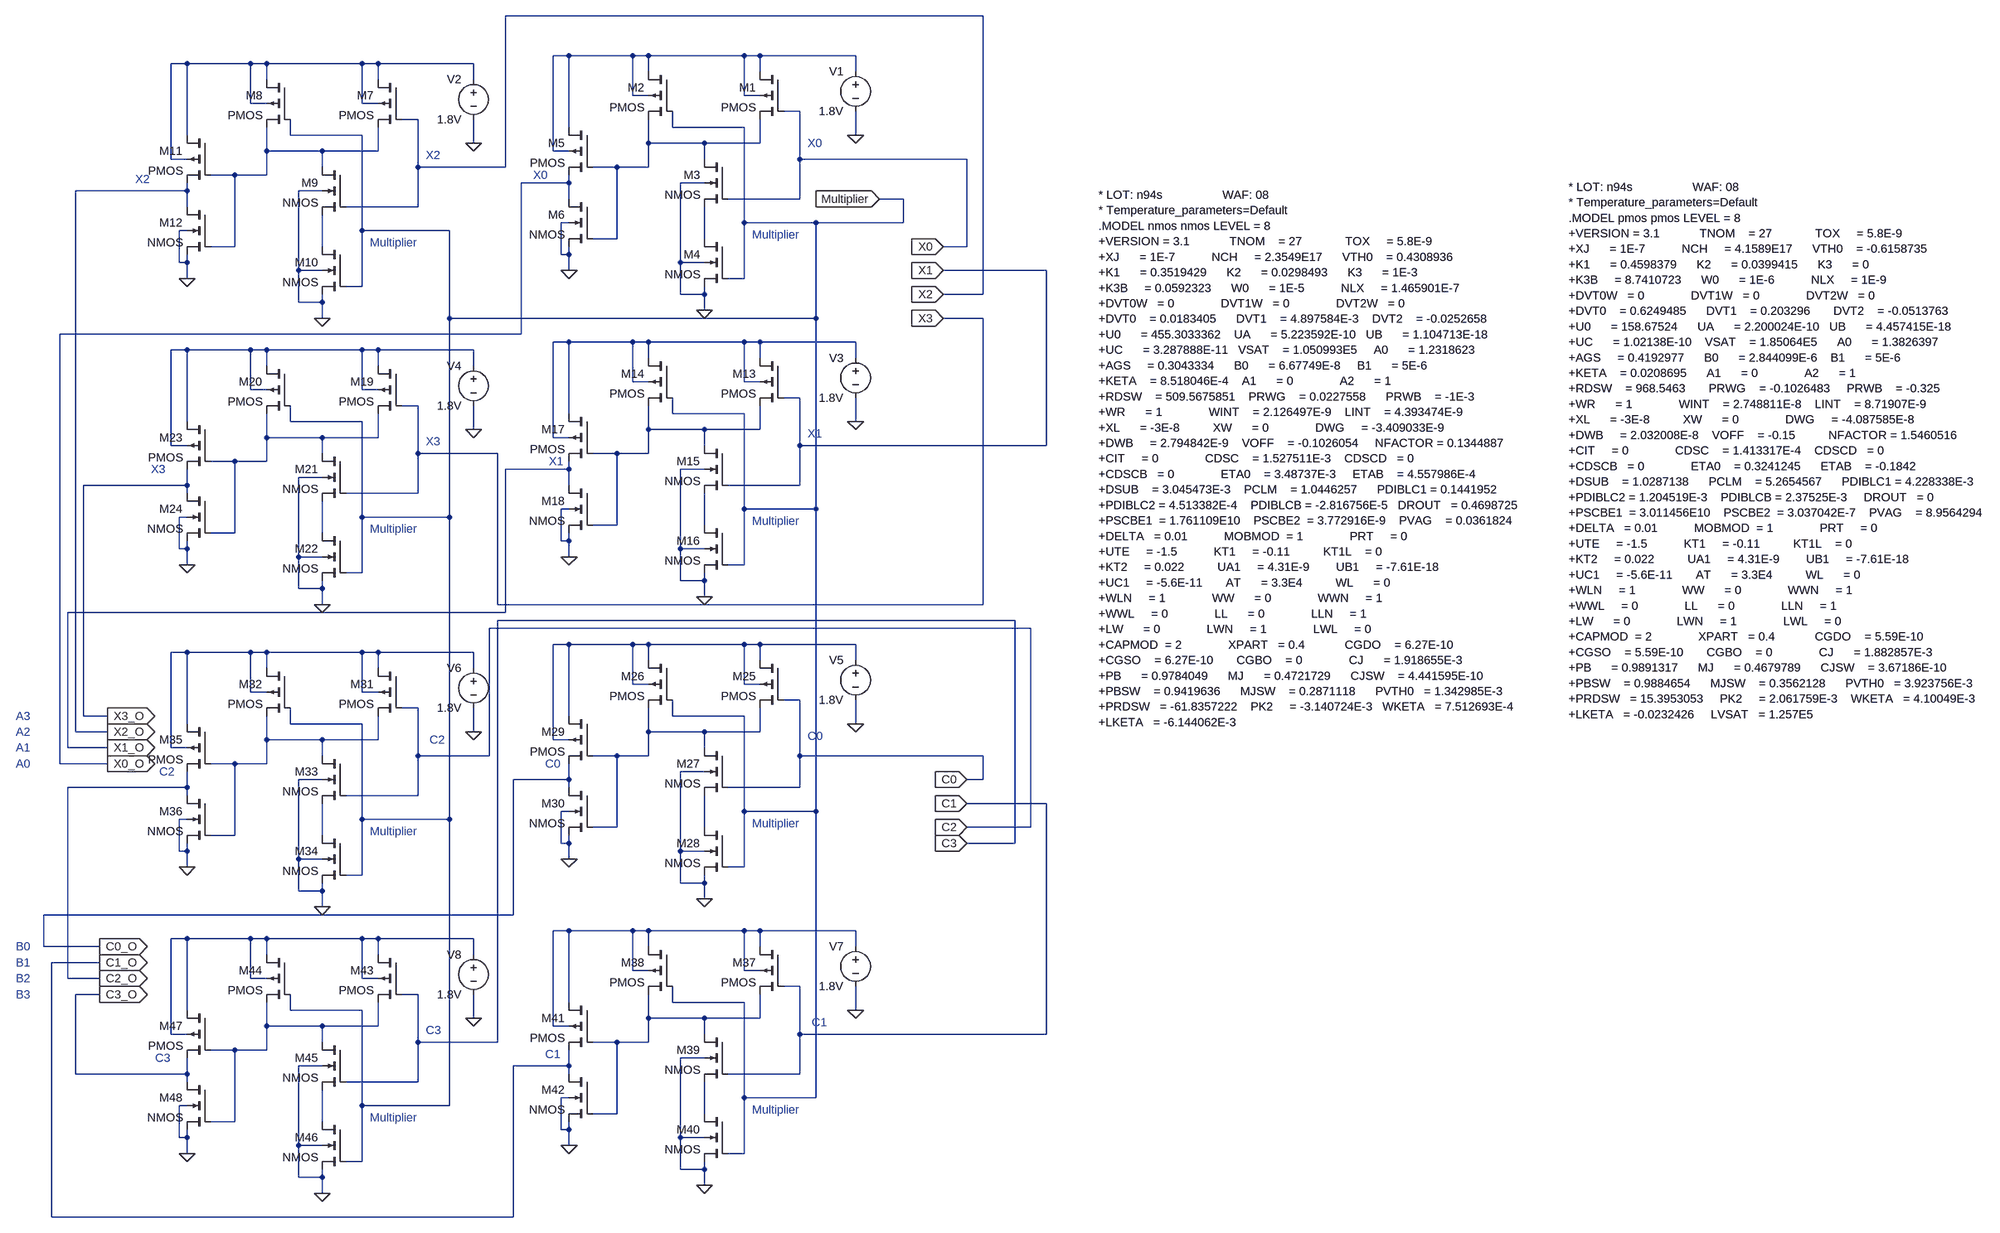
[diagram p0: schematic Logic_Circuit_Multiply.asc]
Logic_Circuit_Multiply.asc, the LTspice schematic file:
Version 4
SHEET 1 4616 1940
WIRE 1552 -480 592 -480
WIRE 720 -400 688 -400
WIRE 848 -400 720 -400
WIRE 880 -400 848 -400
WIRE 1072 -400 880 -400
WIRE 1104 -400 1072 -400
WIRE 1296 -400 1104 -400
WIRE -48 -384 -80 -384
WIRE 80 -384 -48 -384
WIRE 112 -384 80 -384
WIRE 304 -384 112 -384
WIRE 336 -384 304 -384
WIRE 528 -384 336 -384
WIRE 880 -368 880 -400
WIRE 1104 -368 1104 -400
WIRE 1296 -368 1296 -400
WIRE 112 -352 112 -384
WIRE 336 -352 336 -384
WIRE 528 -352 528 -384
WIRE 848 -320 848 -400
WIRE 880 -320 848 -320
WIRE 1072 -320 1072 -400
WIRE 1104 -320 1072 -320
WIRE 80 -304 80 -384
WIRE 112 -304 80 -304
WIRE 304 -304 304 -384
WIRE 336 -304 304 -304
WIRE 1184 -288 1152 -288
WIRE 416 -272 384 -272
WIRE 720 -256 720 -400
WIRE 928 -256 928 -288
WIRE 1072 -256 928 -256
WIRE -48 -240 -48 -384
WIRE 160 -240 160 -272
WIRE 304 -240 160 -240
WIRE 1296 -240 1296 -288
WIRE 528 -224 528 -272
WIRE 880 -224 880 -272
WIRE 992 -224 880 -224
WIRE 1104 -224 1104 -272
WIRE 1104 -224 992 -224
WIRE 112 -208 112 -256
WIRE 224 -208 112 -208
WIRE 336 -208 336 -256
WIRE 336 -208 224 -208
WIRE 688 -208 688 -400
WIRE 720 -208 688 -208
WIRE -80 -192 -80 -384
WIRE -48 -192 -80 -192
WIRE 992 -192 992 -224
WIRE 1184 -192 1184 -288
WIRE 1520 -192 1184 -192
WIRE 224 -176 224 -208
WIRE 416 -176 416 -272
WIRE 592 -176 592 -480
WIRE 592 -176 416 -176
WIRE 816 -176 768 -176
WIRE 880 -176 880 -224
WIRE 880 -176 816 -176
WIRE 48 -160 0 -160
WIRE 112 -160 112 -208
WIRE 112 -160 48 -160
WIRE 720 -144 720 -160
WIRE 720 -144 624 -144
WIRE 992 -144 944 -144
WIRE -48 -128 -48 -144
WIRE -48 -128 -272 -128
WIRE 224 -128 176 -128
WIRE 720 -112 720 -144
WIRE 1184 -112 1184 -192
WIRE 1184 -112 1040 -112
WIRE 1392 -112 1344 -112
WIRE -48 -96 -48 -128
WIRE 416 -96 416 -176
WIRE 416 -96 272 -96
WIRE 720 -64 704 -64
WIRE 1072 -64 1072 -256
WIRE 1216 -64 1072 -64
WIRE 1392 -64 1392 -112
WIRE 1392 -64 1216 -64
WIRE -48 -48 -64 -48
WIRE 304 -48 304 -240
WIRE 480 -48 304 -48
WIRE 816 -32 816 -176
WIRE 816 -32 768 -32
WIRE 992 -32 992 -96
WIRE 48 -16 48 -160
WIRE 48 -16 0 -16
WIRE 224 -16 224 -80
WIRE 1520 -16 1520 -192
WIRE 1520 -16 1472 -16
WIRE 704 0 704 -64
WIRE 720 0 720 -16
WIRE 720 0 704 0
WIRE -64 16 -64 -48
WIRE -48 16 -48 0
WIRE -48 16 -64 16
WIRE 944 16 944 -144
WIRE 992 16 944 16
WIRE 176 32 176 -128
WIRE 224 32 176 32
WIRE 720 32 720 0
WIRE 1680 32 1472 32
WIRE -48 48 -48 16
WIRE 1072 48 1072 -64
WIRE 1072 48 1040 48
WIRE 304 64 304 -48
WIRE 304 64 272 64
WIRE 944 80 944 16
WIRE 992 80 992 64
WIRE 992 80 944 80
WIRE 1552 80 1552 -480
WIRE 1552 80 1472 80
WIRE 176 96 176 32
WIRE 224 96 224 80
WIRE 224 96 176 96
WIRE 992 112 992 80
WIRE 224 128 224 96
WIRE 480 128 480 -48
WIRE 1216 128 1216 -64
WIRE 1216 128 480 128
WIRE 1552 128 1472 128
WIRE 624 160 624 -144
WIRE 624 160 -304 160
WIRE 720 176 688 176
WIRE 848 176 720 176
WIRE 880 176 848 176
WIRE 1072 176 880 176
WIRE 1104 176 1072 176
WIRE 1296 176 1104 176
WIRE -48 192 -80 192
WIRE 80 192 -48 192
WIRE 112 192 80 192
WIRE 304 192 112 192
WIRE 336 192 304 192
WIRE 528 192 336 192
WIRE 880 208 880 176
WIRE 1104 208 1104 176
WIRE 1296 208 1296 176
WIRE 112 224 112 192
WIRE 336 224 336 192
WIRE 528 224 528 192
WIRE 848 256 848 176
WIRE 880 256 848 256
WIRE 1072 256 1072 176
WIRE 1104 256 1072 256
WIRE 80 272 80 192
WIRE 112 272 80 272
WIRE 304 272 304 192
WIRE 336 272 304 272
WIRE 1184 288 1152 288
WIRE 416 304 384 304
WIRE 720 320 720 176
WIRE 928 320 928 288
WIRE 1072 320 928 320
WIRE -48 336 -48 192
WIRE 160 336 160 304
WIRE 304 336 160 336
WIRE 1296 336 1296 288
WIRE 528 352 528 304
WIRE 880 352 880 304
WIRE 992 352 880 352
WIRE 1104 352 1104 304
WIRE 1104 352 992 352
WIRE 112 368 112 320
WIRE 224 368 112 368
WIRE 336 368 336 320
WIRE 336 368 224 368
WIRE 688 368 688 176
WIRE 720 368 688 368
WIRE -80 384 -80 192
WIRE -48 384 -80 384
WIRE 992 384 992 352
WIRE 1184 384 1184 288
WIRE 1680 384 1680 32
WIRE 1680 384 1184 384
WIRE 224 400 224 368
WIRE 416 400 416 304
WIRE 576 400 416 400
WIRE 816 400 768 400
WIRE 880 400 880 352
WIRE 880 400 816 400
WIRE 48 416 0 416
WIRE 112 416 112 368
WIRE 112 416 48 416
WIRE 720 432 720 416
WIRE 720 432 592 432
WIRE 992 432 944 432
WIRE 224 448 176 448
WIRE -48 464 -48 432
WIRE -48 464 -256 464
WIRE 720 464 720 432
WIRE 1184 464 1184 384
WIRE 1184 464 1040 464
WIRE -48 480 -48 464
WIRE 416 480 416 400
WIRE 416 480 272 480
WIRE 720 512 704 512
WIRE 1072 512 1072 320
WIRE 1216 512 1216 128
WIRE 1216 512 1072 512
WIRE -48 528 -64 528
WIRE 304 528 304 336
WIRE 480 528 480 128
WIRE 480 528 304 528
WIRE 816 544 816 400
WIRE 816 544 768 544
WIRE 992 544 992 480
WIRE 48 560 48 416
WIRE 48 560 0 560
WIRE 224 560 224 496
WIRE 704 576 704 512
WIRE 720 576 720 560
WIRE 720 576 704 576
WIRE -64 592 -64 528
WIRE -48 592 -48 576
WIRE -48 592 -64 592
WIRE 944 592 944 432
WIRE 992 592 944 592
WIRE 176 608 176 448
WIRE 224 608 176 608
WIRE 720 608 720 576
WIRE -48 624 -48 592
WIRE 1072 624 1072 512
WIRE 1072 624 1040 624
WIRE 304 640 304 528
WIRE 304 640 272 640
WIRE 944 656 944 592
WIRE 992 656 992 640
WIRE 992 656 944 656
WIRE 176 672 176 608
WIRE 224 672 224 656
WIRE 224 672 176 672
WIRE 992 688 992 656
WIRE 224 704 224 672
WIRE 576 704 576 400
WIRE 1552 704 1552 128
WIRE 1552 704 576 704
WIRE 592 720 592 432
WIRE 592 720 -288 720
WIRE 1616 736 576 736
WIRE 1648 752 560 752
WIRE 720 784 688 784
WIRE 848 784 720 784
WIRE 880 784 848 784
WIRE 1072 784 880 784
WIRE 1104 784 1072 784
WIRE 1296 784 1104 784
WIRE -48 800 -80 800
WIRE 80 800 -48 800
WIRE 112 800 80 800
WIRE 304 800 112 800
WIRE 336 800 304 800
WIRE 528 800 336 800
WIRE 880 816 880 784
WIRE 1104 816 1104 784
WIRE 1296 816 1296 784
WIRE 112 832 112 800
WIRE 336 832 336 800
WIRE 528 832 528 800
WIRE 848 864 848 784
WIRE 880 864 848 864
WIRE 1072 864 1072 784
WIRE 1104 864 1072 864
WIRE 80 880 80 800
WIRE 112 880 80 880
WIRE 304 880 304 800
WIRE 336 880 304 880
WIRE 1184 896 1152 896
WIRE 416 912 384 912
WIRE -256 928 -256 464
WIRE -208 928 -256 928
WIRE 720 928 720 784
WIRE 928 928 928 896
WIRE 1072 928 928 928
WIRE -48 944 -48 800
WIRE 160 944 160 912
WIRE 304 944 160 944
WIRE 1296 944 1296 896
WIRE -272 960 -272 -128
WIRE -208 960 -272 960
WIRE 528 960 528 912
WIRE 880 960 880 912
WIRE 992 960 880 960
WIRE 1104 960 1104 912
WIRE 1104 960 992 960
WIRE 112 976 112 928
WIRE 224 976 112 976
WIRE 336 976 336 928
WIRE 336 976 224 976
WIRE 688 976 688 784
WIRE 720 976 688 976
WIRE -288 992 -288 720
WIRE -208 992 -288 992
WIRE -80 992 -80 800
WIRE -48 992 -80 992
WIRE 992 992 992 960
WIRE 224 1008 224 976
WIRE 416 1008 416 912
WIRE 560 1008 560 752
WIRE 560 1008 416 1008
WIRE 816 1008 768 1008
WIRE 880 1008 880 960
WIRE 880 1008 816 1008
WIRE 1184 1008 1184 896
WIRE 1552 1008 1184 1008
WIRE -304 1024 -304 160
WIRE -208 1024 -304 1024
WIRE 48 1024 0 1024
WIRE 112 1024 112 976
WIRE 112 1024 48 1024
WIRE 992 1040 944 1040
WIRE 224 1056 176 1056
WIRE 720 1056 720 1024
WIRE 720 1056 608 1056
WIRE 1552 1056 1552 1008
WIRE 1552 1056 1520 1056
WIRE -48 1072 -48 1040
WIRE -48 1072 -288 1072
WIRE 720 1072 720 1056
WIRE 1184 1072 1184 1008
WIRE 1184 1072 1040 1072
WIRE -48 1088 -48 1072
WIRE 416 1088 416 1008
WIRE 416 1088 272 1088
WIRE 1680 1104 1520 1104
WIRE 720 1120 704 1120
WIRE 1072 1120 1072 928
WIRE 1216 1120 1216 512
WIRE 1216 1120 1072 1120
WIRE -48 1136 -64 1136
WIRE 304 1136 304 944
WIRE 480 1136 480 528
WIRE 480 1136 304 1136
WIRE 816 1152 816 1008
WIRE 816 1152 768 1152
WIRE 992 1152 992 1088
WIRE 1648 1152 1648 752
WIRE 1648 1152 1520 1152
WIRE 48 1168 48 1024
WIRE 48 1168 0 1168
WIRE 224 1168 224 1104
WIRE 704 1184 704 1120
WIRE 720 1184 720 1168
WIRE 720 1184 704 1184
WIRE 1616 1184 1616 736
WIRE 1616 1184 1520 1184
WIRE -64 1200 -64 1136
WIRE -48 1200 -48 1184
WIRE -48 1200 -64 1200
WIRE 944 1200 944 1040
WIRE 992 1200 944 1200
WIRE 176 1216 176 1056
WIRE 224 1216 176 1216
WIRE 720 1216 720 1184
WIRE -48 1232 -48 1200
WIRE 1072 1232 1072 1120
WIRE 1072 1232 1040 1232
WIRE 304 1248 304 1136
WIRE 304 1248 272 1248
WIRE 944 1264 944 1200
WIRE 992 1264 992 1248
WIRE 992 1264 944 1264
WIRE 176 1280 176 1216
WIRE 224 1280 224 1264
WIRE 224 1280 176 1280
WIRE 992 1296 992 1264
WIRE 224 1312 224 1280
WIRE 608 1328 608 1056
WIRE 608 1328 -336 1328
WIRE 720 1360 688 1360
WIRE 848 1360 720 1360
WIRE 880 1360 848 1360
WIRE 1072 1360 880 1360
WIRE 1104 1360 1072 1360
WIRE 1296 1360 1104 1360
WIRE -48 1376 -80 1376
WIRE 80 1376 -48 1376
WIRE 112 1376 80 1376
WIRE 304 1376 112 1376
WIRE 336 1376 304 1376
WIRE 528 1376 336 1376
WIRE -336 1392 -336 1328
WIRE -224 1392 -336 1392
WIRE 880 1392 880 1360
WIRE 1104 1392 1104 1360
WIRE 1296 1392 1296 1360
WIRE 112 1408 112 1376
WIRE 336 1408 336 1376
WIRE 528 1408 528 1376
WIRE -224 1424 -320 1424
WIRE 848 1440 848 1360
WIRE 880 1440 848 1440
WIRE 1072 1440 1072 1360
WIRE 1104 1440 1072 1440
WIRE -288 1456 -288 1072
WIRE -224 1456 -288 1456
WIRE 80 1456 80 1376
WIRE 112 1456 80 1456
WIRE 304 1456 304 1376
WIRE 336 1456 304 1456
WIRE 1184 1472 1152 1472
WIRE -224 1488 -272 1488
WIRE 416 1488 384 1488
WIRE 720 1504 720 1360
WIRE 928 1504 928 1472
WIRE 1072 1504 928 1504
WIRE -48 1520 -48 1376
WIRE 160 1520 160 1488
WIRE 304 1520 160 1520
WIRE 1296 1520 1296 1472
WIRE 528 1536 528 1488
WIRE 880 1536 880 1488
WIRE 992 1536 880 1536
WIRE 1104 1536 1104 1488
WIRE 1104 1536 992 1536
WIRE 112 1552 112 1504
WIRE 224 1552 112 1552
WIRE 336 1552 336 1504
WIRE 336 1552 224 1552
WIRE 688 1552 688 1360
WIRE 720 1552 688 1552
WIRE -80 1568 -80 1376
WIRE -48 1568 -80 1568
WIRE 992 1568 992 1536
WIRE 1184 1568 1184 1472
WIRE 1680 1568 1680 1104
WIRE 1680 1568 1184 1568
WIRE 224 1584 224 1552
WIRE 416 1584 416 1488
WIRE 576 1584 576 736
WIRE 576 1584 416 1584
WIRE 816 1584 768 1584
WIRE 880 1584 880 1536
WIRE 880 1584 816 1584
WIRE 48 1600 0 1600
WIRE 112 1600 112 1552
WIRE 112 1600 48 1600
WIRE 992 1616 944 1616
WIRE 224 1632 176 1632
WIRE 720 1632 720 1600
WIRE 720 1632 608 1632
WIRE -272 1648 -272 1488
WIRE -48 1648 -48 1616
WIRE -48 1648 -272 1648
WIRE 720 1648 720 1632
WIRE 1184 1648 1184 1568
WIRE 1184 1648 1040 1648
WIRE -48 1664 -48 1648
WIRE 416 1664 416 1584
WIRE 416 1664 272 1664
WIRE 720 1696 704 1696
WIRE 1072 1696 1072 1504
WIRE 1216 1696 1216 1120
WIRE 1216 1696 1072 1696
WIRE -48 1712 -64 1712
WIRE 304 1712 304 1520
WIRE 480 1712 480 1136
WIRE 480 1712 304 1712
WIRE 816 1728 816 1584
WIRE 816 1728 768 1728
WIRE 992 1728 992 1664
WIRE 48 1744 48 1600
WIRE 48 1744 0 1744
WIRE 224 1744 224 1680
WIRE 704 1760 704 1696
WIRE 720 1760 720 1744
WIRE 720 1760 704 1760
WIRE -64 1776 -64 1712
WIRE -48 1776 -48 1760
WIRE -48 1776 -64 1776
WIRE 944 1776 944 1616
WIRE 992 1776 944 1776
WIRE 176 1792 176 1632
WIRE 224 1792 176 1792
WIRE 720 1792 720 1760
WIRE -48 1808 -48 1776
WIRE 1072 1808 1072 1696
WIRE 1072 1808 1040 1808
WIRE 304 1824 304 1712
WIRE 304 1824 272 1824
WIRE 944 1840 944 1776
WIRE 992 1840 992 1824
WIRE 992 1840 944 1840
WIRE 176 1856 176 1792
WIRE 224 1856 224 1840
WIRE 224 1856 176 1856
WIRE 992 1872 992 1840
WIRE 224 1888 224 1856
WIRE -320 1936 -320 1424
WIRE 608 1936 608 1632
WIRE 608 1936 -320 1936
FLAG 992 112 0
FLAG 720 32 0
FLAG 1296 -240 0
FLAG 224 128 0
FLAG -48 48 0
FLAG 528 -224 0
FLAG 992 688 0
FLAG 720 608 0
FLAG 1296 336 0
FLAG 224 704 0
FLAG -48 624 0
FLAG 528 352 0
FLAG 992 1296 0
FLAG 720 1216 0
FLAG 1296 944 0
FLAG 224 1312 0
FLAG -48 1232 0
FLAG 528 960 0
FLAG 992 1872 0
FLAG 720 1792 0
FLAG 1296 1520 0
FLAG 224 1888 0
FLAG -48 1808 0
FLAG 528 1536 0
FLAG 1344 -112 Multiplier
IOPIN 1344 -112 In
FLAG 1472 -16 X0
IOPIN 1472 -16 In
FLAG 1472 32 X1
IOPIN 1472 32 In
FLAG 1472 80 X2
IOPIN 1472 80 In
FLAG 1472 128 X3
IOPIN 1472 128 In
FLAG -208 1024 X0_O
IOPIN -208 1024 Out
FLAG -208 992 X1_O
IOPIN -208 992 Out
FLAG -208 960 X2_O
IOPIN -208 960 Out
FLAG -208 928 X3_O
IOPIN -208 928 Out
FLAG 1520 1056 C0
IOPIN 1520 1056 In
FLAG 1520 1104 C1
IOPIN 1520 1104 In
FLAG 1520 1152 C2
IOPIN 1520 1152 In
FLAG 1520 1184 C3
IOPIN 1520 1184 In
FLAG -224 1392 C0_O
IOPIN -224 1392 Out
FLAG -224 1424 C1_O
IOPIN -224 1424 Out
FLAG -224 1456 C2_O
IOPIN -224 1456 Out
FLAG -224 1488 C3_O
IOPIN -224 1488 Out
SYMBOL pmos4 1152 -368 M0
SYMATTR InstName M1
SYMATTR Value2 l=180n w=880n
SYMBOL pmos4 928 -368 M0
SYMATTR InstName M2
SYMATTR Value2 l=180n w=880n
SYMBOL nmos4 1040 -192 M0
SYMATTR InstName M3
SYMATTR Value2 l=180n w=880n
SYMBOL nmos4 1040 -32 M0
SYMATTR InstName M4
SYMATTR Value2 l=180n w=880n
SYMBOL pmos4 768 -256 M0
SYMATTR InstName M5
SYMATTR Value2 l=180n w=880n
SYMBOL nmos4 768 -112 M0
SYMATTR InstName M6
SYMATTR Value2 l=180n w=440n
SYMBOL voltage 1296 -384 M0
WINDOW 123 0 0 Left 0
WINDOW 39 0 0 Left 0
SYMATTR InstName V1
SYMATTR Value 1.8V
SYMBOL pmos4 384 -352 M0
SYMATTR InstName M7
SYMATTR Value2 l=180n w=880n
SYMBOL pmos4 160 -352 M0
SYMATTR InstName M8
SYMATTR Value2 l=180n w=880n
SYMBOL nmos4 272 -176 M0
SYMATTR InstName M9
SYMATTR Value2 l=180n w=880n
SYMBOL nmos4 272 -16 M0
SYMATTR InstName M10
SYMATTR Value2 l=180n w=880n
SYMBOL pmos4 0 -240 M0
SYMATTR InstName M11
SYMATTR Value2 l=180n w=880n
SYMBOL nmos4 0 -96 M0
SYMATTR InstName M12
SYMATTR Value2 l=180n w=440n
SYMBOL voltage 528 -368 M0
WINDOW 123 0 0 Left 0
WINDOW 39 0 0 Left 0
SYMATTR InstName V2
SYMATTR Value 1.8V
SYMBOL pmos4 1152 208 M0
SYMATTR InstName M13
SYMATTR Value2 l=180n w=880n
SYMBOL pmos4 928 208 M0
SYMATTR InstName M14
SYMATTR Value2 l=180n w=880n
SYMBOL nmos4 1040 384 M0
SYMATTR InstName M15
SYMATTR Value2 l=180n w=880n
SYMBOL nmos4 1040 544 M0
SYMATTR InstName M16
SYMATTR Value2 l=180n w=880n
SYMBOL pmos4 768 320 M0
SYMATTR InstName M17
SYMATTR Value2 l=180n w=880n
SYMBOL nmos4 768 464 M0
SYMATTR InstName M18
SYMATTR Value2 l=180n w=440n
SYMBOL voltage 1296 192 M0
WINDOW 123 0 0 Left 0
WINDOW 39 0 0 Left 0
SYMATTR InstName V3
SYMATTR Value 1.8V
SYMBOL pmos4 384 224 M0
SYMATTR InstName M19
SYMATTR Value2 l=180n w=880n
SYMBOL pmos4 160 224 M0
SYMATTR InstName M20
SYMATTR Value2 l=180n w=880n
SYMBOL nmos4 272 400 M0
SYMATTR InstName M21
SYMATTR Value2 l=180n w=880n
SYMBOL nmos4 272 560 M0
SYMATTR InstName M22
SYMATTR Value2 l=180n w=880n
SYMBOL pmos4 0 336 M0
SYMATTR InstName M23
SYMATTR Value2 l=180n w=880n
SYMBOL nmos4 0 480 M0
SYMATTR InstName M24
SYMATTR Value2 l=180n w=440n
SYMBOL voltage 528 208 M0
WINDOW 123 0 0 Left 0
WINDOW 39 0 0 Left 0
SYMATTR InstName V4
SYMATTR Value 1.8V
SYMBOL pmos4 1152 816 M0
SYMATTR InstName M25
SYMATTR Value2 l=180n w=880n
SYMBOL pmos4 928 816 M0
SYMATTR InstName M26
SYMATTR Value2 l=180n w=880n
SYMBOL nmos4 1040 992 M0
SYMATTR InstName M27
SYMATTR Value2 l=180n w=880n
SYMBOL nmos4 1040 1152 M0
SYMATTR InstName M28
SYMATTR Value2 l=180n w=880n
SYMBOL pmos4 768 928 M0
SYMATTR InstName M29
SYMATTR Value2 l=180n w=880n
SYMBOL nmos4 768 1072 M0
SYMATTR InstName M30
SYMATTR Value2 l=180n w=440n
SYMBOL voltage 1296 800 M0
WINDOW 123 0 0 Left 0
WINDOW 39 0 0 Left 0
SYMATTR InstName V5
SYMATTR Value 1.8V
SYMBOL pmos4 384 832 M0
SYMATTR InstName M31
SYMATTR Value2 l=180n w=880n
SYMBOL pmos4 160 832 M0
SYMATTR InstName M32
SYMATTR Value2 l=180n w=880n
SYMBOL nmos4 272 1008 M0
SYMATTR InstName M33
SYMATTR Value2 l=180n w=880n
SYMBOL nmos4 272 1168 M0
SYMATTR InstName M34
SYMATTR Value2 l=180n w=880n
SYMBOL pmos4 0 944 M0
SYMATTR InstName M35
SYMATTR Value2 l=180n w=880n
SYMBOL nmos4 0 1088 M0
SYMATTR InstName M36
SYMATTR Value2 l=180n w=440n
SYMBOL voltage 528 816 M0
WINDOW 123 0 0 Left 0
WINDOW 39 0 0 Left 0
SYMATTR InstName V6
SYMATTR Value 1.8V
SYMBOL pmos4 1152 1392 M0
SYMATTR InstName M37
SYMATTR Value2 l=180n w=880n
SYMBOL pmos4 928 1392 M0
SYMATTR InstName M38
SYMATTR Value2 l=180n w=880n
SYMBOL nmos4 1040 1568 M0
SYMATTR InstName M39
SYMATTR Value2 l=180n w=880n
SYMBOL nmos4 1040 1728 M0
SYMATTR InstName M40
SYMATTR Value2 l=180n w=880n
SYMBOL pmos4 768 1504 M0
SYMATTR InstName M41
SYMATTR Value2 l=180n w=880n
SYMBOL nmos4 768 1648 M0
SYMATTR InstName M42
SYMATTR Value2 l=180n w=440n
SYMBOL voltage 1296 1376 M0
WINDOW 123 0 0 Left 0
WINDOW 39 0 0 Left 0
SYMATTR InstName V7
SYMATTR Value 1.8V
SYMBOL pmos4 384 1408 M0
SYMATTR InstName M43
SYMATTR Value2 l=180n w=880n
SYMBOL pmos4 160 1408 M0
SYMATTR InstName M44
SYMATTR Value2 l=180n w=880n
SYMBOL nmos4 272 1584 M0
SYMATTR InstName M45
SYMATTR Value2 l=180n w=880n
SYMBOL nmos4 272 1744 M0
SYMATTR InstName M46
SYMATTR Value2 l=180n w=880n
SYMBOL pmos4 0 1520 M0
SYMATTR InstName M47
SYMATTR Value2 l=180n w=880n
SYMBOL nmos4 0 1664 M0
SYMATTR InstName M48
SYMATTR Value2 l=180n w=440n
SYMBOL voltage 528 1392 M0
WINDOW 123 0 0 Left 0
WINDOW 39 0 0 Left 0
SYMATTR InstName V8
SYMATTR Value 1.8V
TEXT -392 1024 Left 2 ;A0
TEXT -392 1392 Left 2 ;B0
TEXT -392 992 Left 2 ;A1
TEXT -392 1424 Left 2 ;B1
TEXT -392 960 Left 2 ;A2
TEXT -392 928 Left 2 ;A3
TEXT -392 1456 Left 2 ;B2
TEXT -392 1488 Left 2 ;B3
TEXT 1088 -40 Left 2 ;Multiplier
TEXT 320 -24 Left 2 ;Multiplier
TEXT 1088 536 Left 2 ;Multiplier
TEXT 320 552 Left 2 ;Multiplier
TEXT 1088 1144 Left 2 ;Multiplier
TEXT 320 1160 Left 2 ;Multiplier
TEXT 1088 1720 Left 2 ;Multiplier
TEXT 320 1736 Left 2 ;Multiplier
TEXT 1200 968 Left 2 ;C0
TEXT 1208 1544 Left 2 ;C1
TEXT 1200 -224 Left 2 ;X0
TEXT 1200 360 Left 2 ;X1
TEXT 432 -200 Left 2 ;X2
TEXT 432 376 Left 2 ;X3
TEXT 440 976 Left 2 ;C2
TEXT 432 1560 Left 2 ;C3
TEXT 648 -160 Left 2 ;X0
TEXT -152 -152 Left 2 ;X2
TEXT -120 432 Left 2 ;X3
TEXT 680 416 Left 2 ;X1
TEXT 672 1024 Left 2 ;C0
TEXT -104 1040 Left 2 ;C2
TEXT 672 1608 Left 2 ;C1
TEXT -112 1616 Left 2 ;C3
TEXT 2776 -120 Left 2 !* LOT: n94s                  WAF: 08\n* Temperature_parameters=Default\n.MODEL nmos nmos LEVEL = 8\n+VERSION = 3.1            TNOM    = 27             TOX     = 5.8E-9\n+XJ      = 1E-7           NCH     = 2.3549E17      VTH0    = 0.4308936\n+K1      = 0.3519429      K2      = 0.0298493      K3      = 1E-3\n+K3B     = 0.0592323      W0      = 1E-5           NLX     = 1.465901E-7\n+DVT0W   = 0              DVT1W   = 0              DVT2W   = 0\n+DVT0    = 0.0183405      DVT1    = 4.897584E-3    DVT2    = -0.0252658\n+U0      = 455.3033362    UA      = 5.223592E-10   UB      = 1.104713E-18\n+UC      = 3.287888E-11   VSAT    = 1.050993E5     A0      = 1.2318623\n+AGS     = 0.3043334      B0      = 6.67749E-8     B1      = 5E-6\n+KETA    = 8.518046E-4    A1      = 0              A2      = 1\n+RDSW    = 509.5675851    PRWG    = 0.0227558      PRWB    = -1E-3\n+WR      = 1              WINT    = 2.126497E-9    LINT    = 4.393474E-9\n+XL      = -3E-8          XW      = 0              DWG     = -3.409033E-9\n+DWB     = 2.794842E-9    VOFF    = -0.1026054     NFACTOR = 0.1344887\n+CIT     = 0              CDSC    = 1.527511E-3    CDSCD   = 0\n+CDSCB   = 0              ETA0    = 3.48737E-3     ETAB    = 4.557986E-4\n+DSUB    = 3.045473E-3    PCLM    = 1.0446257      PDIBLC1 = 0.1441952\n+PDIBLC2 = 4.513382E-4    PDIBLCB = -2.816756E-5   DROUT   = 0.4698725\n+PSCBE1  = 1.761109E10    PSCBE2  = 3.772916E-9    PVAG    = 0.0361824\n+DELTA   = 0.01           MOBMOD  = 1              PRT     = 0\n+UTE     = -1.5           KT1     = -0.11          KT1L    = 0\n+KT2     = 0.022          UA1     = 4.31E-9        UB1     = -7.61E-18\n+UC1     = -5.6E-11       AT      = 3.3E4          WL      = 0\n+WLN     = 1              WW      = 0              WWN     = 1\n+WWL     = 0              LL      = 0              LLN     = 1\n+LW      = 0              LWN     = 1              LWL     = 0\n+CAPMOD  = 2              XPART   = 0.4            CGDO    = 6.27E-10\n+CGSO    = 6.27E-10       CGBO    = 0              CJ      = 1.918655E-3\n+PB      = 0.9784049      MJ      = 0.4721729      CJSW    = 4.441595E-10\n+PBSW    = 0.9419636      MJSW    = 0.2871118      PVTH0   = 1.342985E-3\n+PRDSW   = -61.8357222    PK2     = -3.140724E-3   WKETA   = 7.512693E-4\n+LKETA   = -6.144062E-3
TEXT 3736 -136 Left 2 !* LOT: n94s                  WAF: 08\n* Temperature_parameters=Default\n.MODEL pmos pmos LEVEL = 8\n+VERSION = 3.1            TNOM    = 27             TOX     = 5.8E-9\n+XJ      = 1E-7           NCH     = 4.1589E17      VTH0    = -0.6158735\n+K1      = 0.4598379      K2      = 0.0399415      K3      = 0\n+K3B     = 8.7410723      W0      = 1E-6           NLX     = 1E-9\n+DVT0W   = 0              DVT1W   = 0              DVT2W   = 0\n+DVT0    = 0.6249485      DVT1    = 0.203296       DVT2    = -0.0513763\n+U0      = 158.67524      UA      = 2.200024E-10   UB      = 4.457415E-18\n+UC      = 1.02138E-10    VSAT    = 1.85064E5      A0      = 1.3826397\n+AGS     = 0.4192977      B0      = 2.844099E-6    B1      = 5E-6\n+KETA    = 0.0208695      A1      = 0              A2      = 1\n+RDSW    = 968.5463       PRWG    = -0.1026483     PRWB    = -0.325\n+WR      = 1              WINT    = 2.748811E-8    LINT    = 8.71907E-9\n+XL      = -3E-8          XW      = 0              DWG     = -4.087585E-8\n+DWB     = 2.032008E-8    VOFF    = -0.15          NFACTOR = 1.5460516\n+CIT     = 0              CDSC    = 1.413317E-4    CDSCD   = 0\n+CDSCB   = 0              ETA0    = 0.3241245      ETAB    = -0.1842\n+DSUB    = 1.0287138      PCLM    = 5.2654567      PDIBLC1 = 4.228338E-3\n+PDIBLC2 = 1.204519E-3    PDIBLCB = 2.37525E-3     DROUT   = 0\n+PSCBE1  = 3.011456E10    PSCBE2  = 3.037042E-7    PVAG    = 8.9564294\n+DELTA   = 0.01           MOBMOD  = 1              PRT     = 0\n+UTE     = -1.5           KT1     = -0.11          KT1L    = 0\n+KT2     = 0.022          UA1     = 4.31E-9        UB1     = -7.61E-18\n+UC1     = -5.6E-11       AT      = 3.3E4          WL      = 0\n+WLN     = 1              WW      = 0              WWN     = 1\n+WWL     = 0              LL      = 0              LLN     = 1\n+LW      = 0              LWN     = 1              LWL     = 0\n+CAPMOD  = 2              XPART   = 0.4            CGDO    = 5.59E-10\n+CGSO    = 5.59E-10       CGBO    = 0              CJ      = 1.882857E-3\n+PB      = 0.9891317      MJ      = 0.4679789      CJSW    = 3.67186E-10\n+PBSW    = 0.9884654      MJSW    = 0.3562128      PVTH0   = 3.923756E-3\n+PRDSW   = 15.3953053     PK2     = 2.061759E-3    WKETA   = 4.10049E-3\n+LKETA   = -0.0232426     LVSAT   = 1.257E5

The netlist it stands for:
* Logic_Circuit_Multiply.asc
M1 N001 X0 N003 N001 PMOS l=180n w=880n
M2 N001 Multiplier N003 N001 PMOS l=180n w=880n
M3 N003 X0 N005 0 NMOS l=180n w=880n
M4 N005 Multiplier 0 0 NMOS l=180n w=880n
M5 N001 N003 X0_O N001 PMOS l=180n w=880n
M6 X0_O N003 0 0 NMOS l=180n w=440n
V1 N001 0 1.8V
M7 N002 X2 N004 N002 PMOS l=180n w=880n
M8 N002 Multiplier N004 N002 PMOS l=180n w=880n
M9 N004 X2 N006 0 NMOS l=180n w=880n
M10 N006 Multiplier 0 0 NMOS l=180n w=880n
M11 N002 N004 X2_O N002 PMOS l=180n w=880n
M12 X2_O N004 0 0 NMOS l=180n w=440n
V2 N002 0 1.8V
M13 N007 X1 N009 N007 PMOS l=180n w=880n
M14 N007 Multiplier N009 N007 PMOS l=180n w=880n
M15 N009 X1 N011 0 NMOS l=180n w=880n
M16 N011 Multiplier 0 0 NMOS l=180n w=880n
M17 N007 N009 X1_O N007 PMOS l=180n w=880n
M18 X1_O N009 0 0 NMOS l=180n w=440n
V3 N007 0 1.8V
M19 N008 X3 N010 N008 PMOS l=180n w=880n
M20 N008 Multiplier N010 N008 PMOS l=180n w=880n
M21 N010 X3 N012 0 NMOS l=180n w=880n
M22 N012 Multiplier 0 0 NMOS l=180n w=880n
M23 N008 N010 X3_O N008 PMOS l=180n w=880n
M24 X3_O N010 0 0 NMOS l=180n w=440n
V4 N008 0 1.8V
M25 N013 C0 N015 N013 PMOS l=180n w=880n
M26 N013 Multiplier N015 N013 PMOS l=180n w=880n
M27 N015 C0 N017 0 NMOS l=180n w=880n
M28 N017 Multiplier 0 0 NMOS l=180n w=880n
M29 N013 N015 C0_O N013 PMOS l=180n w=880n
M30 C0_O N015 0 0 NMOS l=180n w=440n
V5 N013 0 1.8V
M31 N014 C2 N016 N014 PMOS l=180n w=880n
M32 N014 Multiplier N016 N014 PMOS l=180n w=880n
M33 N016 C2 N018 0 NMOS l=180n w=880n
M34 N018 Multiplier 0 0 NMOS l=180n w=880n
M35 N014 N016 C2_O N014 PMOS l=180n w=880n
M36 C2_O N016 0 0 NMOS l=180n w=440n
V6 N014 0 1.8V
M37 N019 C1 N021 N019 PMOS l=180n w=880n
M38 N019 Multiplier N021 N019 PMOS l=180n w=880n
M39 N021 C1 N023 0 NMOS l=180n w=880n
M40 N023 Multiplier 0 0 NMOS l=180n w=880n
M41 N019 N021 C1_O N019 PMOS l=180n w=880n
M42 C1_O N021 0 0 NMOS l=180n w=440n
V7 N019 0 1.8V
M43 N020 C3 N022 N020 PMOS l=180n w=880n
M44 N020 Multiplier N022 N020 PMOS l=180n w=880n
M45 N022 C3 N024 0 NMOS l=180n w=880n
M46 N024 Multiplier 0 0 NMOS l=180n w=880n
M47 N020 N022 C3_O N020 PMOS l=180n w=880n
M48 C3_O N022 0 0 NMOS l=180n w=440n
V8 N020 0 1.8V
.model NMOS NMOS
.model PMOS PMOS
.lib standard.mos
* A0
* B0
* A1
* B1
* A2
* A3
* B2
* B3
* Multiplier
* Multiplier
* Multiplier
* Multiplier
* Multiplier
* Multiplier
* Multiplier
* Multiplier
* C0
* C1
* X0
* X1
* X2
* X3
* C2
* C3
* X0
* X2
* X3
* X1
* C0
* C2
* C1
* C3
* LOT: n94s                  WAF: 08
* Temperature_parameters=Default
.MODEL nmos nmos LEVEL = 8
+VERSION = 3.1            TNOM    = 27             TOX     = 5.8E-9
+XJ      = 1E-7           NCH     = 2.3549E17      VTH0    = 0.4308936
+K1      = 0.3519429      K2      = 0.0298493      K3      = 1E-3
+K3B     = 0.0592323      W0      = 1E-5           NLX     = 1.465901E-7
+DVT0W   = 0              DVT1W   = 0              DVT2W   = 0
+DVT0    = 0.0183405      DVT1    = 4.897584E-3    DVT2    = -0.0252658
+U0      = 455.3033362    UA      = 5.223592E-10   UB      = 1.104713E-18
+UC      = 3.287888E-11   VSAT    = 1.050993E5     A0      = 1.2318623
+AGS     = 0.3043334      B0      = 6.67749E-8     B1      = 5E-6
+KETA    = 8.518046E-4    A1      = 0              A2      = 1
+RDSW    = 509.5675851    PRWG    = 0.0227558      PRWB    = -1E-3
+WR      = 1              WINT    = 2.126497E-9    LINT    = 4.393474E-9
+XL      = -3E-8          XW      = 0              DWG     = -3.409033E-9
+DWB     = 2.794842E-9    VOFF    = -0.1026054     NFACTOR = 0.1344887
+CIT     = 0              CDSC    = 1.527511E-3    CDSCD   = 0
+CDSCB   = 0              ETA0    = 3.48737E-3     ETAB    = 4.557986E-4
+DSUB    = 3.045473E-3    PCLM    = 1.0446257      PDIBLC1 = 0.1441952
+PDIBLC2 = 4.513382E-4    PDIBLCB = -2.816756E-5   DROUT   = 0.4698725
+PSCBE1  = 1.761109E10    PSCBE2  = 3.772916E-9    PVAG    = 0.0361824
+DELTA   = 0.01           MOBMOD  = 1              PRT     = 0
+UTE     = -1.5           KT1     = -0.11          KT1L    = 0
+KT2     = 0.022          UA1     = 4.31E-9        UB1     = -7.61E-18
+UC1     = -5.6E-11       AT      = 3.3E4          WL      = 0
+WLN     = 1              WW      = 0              WWN     = 1
+WWL     = 0              LL      = 0              LLN     = 1
+LW      = 0              LWN     = 1              LWL     = 0
+CAPMOD  = 2              XPART   = 0.4            CGDO    = 6.27E-10
+CGSO    = 6.27E-10       CGBO    = 0              CJ      = 1.918655E-3
+PB      = 0.9784049      MJ      = 0.4721729      CJSW    = 4.441595E-10
+PBSW    = 0.9419636      MJSW    = 0.2871118      PVTH0   = 1.342985E-3
+PRDSW   = -61.8357222    PK2     = -3.140724E-3   WKETA   = 7.512693E-4
+LKETA   = -6.144062E-3
* LOT: n94s                  WAF: 08
* Temperature_parameters=Default
.MODEL pmos pmos LEVEL = 8
+VERSION = 3.1            TNOM    = 27             TOX     = 5.8E-9
+XJ      = 1E-7           NCH     = 4.1589E17      VTH0    = -0.6158735
+K1      = 0.4598379      K2      = 0.0399415      K3      = 0
+K3B     = 8.7410723      W0      = 1E-6           NLX     = 1E-9
+DVT0W   = 0              DVT1W   = 0              DVT2W   = 0
+DVT0    = 0.6249485      DVT1    = 0.203296       DVT2    = -0.0513763
+U0      = 158.67524      UA      = 2.200024E-10   UB      = 4.457415E-18
+UC      = 1.02138E-10    VSAT    = 1.85064E5      A0      = 1.3826397
+AGS     = 0.4192977      B0      = 2.844099E-6    B1      = 5E-6
+KETA    = 0.0208695      A1      = 0              A2      = 1
+RDSW    = 968.5463       PRWG    = -0.1026483     PRWB    = -0.325
+WR      = 1              WINT    = 2.748811E-8    LINT    = 8.71907E-9
+XL      = -3E-8          XW      = 0              DWG     = -4.087585E-8
+DWB     = 2.032008E-8    VOFF    = -0.15          NFACTOR = 1.5460516
+CIT     = 0              CDSC    = 1.413317E-4    CDSCD   = 0
+CDSCB   = 0              ETA0    = 0.3241245      ETAB    = -0.1842
+DSUB    = 1.0287138      PCLM    = 5.2654567      PDIBLC1 = 4.228338E-3
+PDIBLC2 = 1.204519E-3    PDIBLCB = 2.37525E-3     DROUT   = 0
+PSCBE1  = 3.011456E10    PSCBE2  = 3.037042E-7    PVAG    = 8.9564294
+DELTA   = 0.01           MOBMOD  = 1              PRT     = 0
+UTE     = -1.5           KT1     = -0.11          KT1L    = 0
+KT2     = 0.022          UA1     = 4.31E-9        UB1     = -7.61E-18
+UC1     = -5.6E-11       AT      = 3.3E4          WL      = 0
+WLN     = 1              WW      = 0              WWN     = 1
+WWL     = 0              LL      = 0              LLN     = 1
+LW      = 0              LWN     = 1              LWL     = 0
+CAPMOD  = 2              XPART   = 0.4            CGDO    = 5.59E-10
+CGSO    = 5.59E-10       CGBO    = 0              CJ      = 1.882857E-3
+PB      = 0.9891317      MJ      = 0.4679789      CJSW    = 3.67186E-10
+PBSW    = 0.9884654      MJSW    = 0.3562128      PVTH0   = 3.923756E-3
+PRDSW   = 15.3953053     PK2     = 2.061759E-3    WKETA   = 4.10049E-3
+LKETA   = -0.0232426     LVSAT   = 1.257E5
.backanno
.end